# EAGLE schematic Symposion_K3_Arduino-Peripherie-IF (EAGLE 9.6.2)
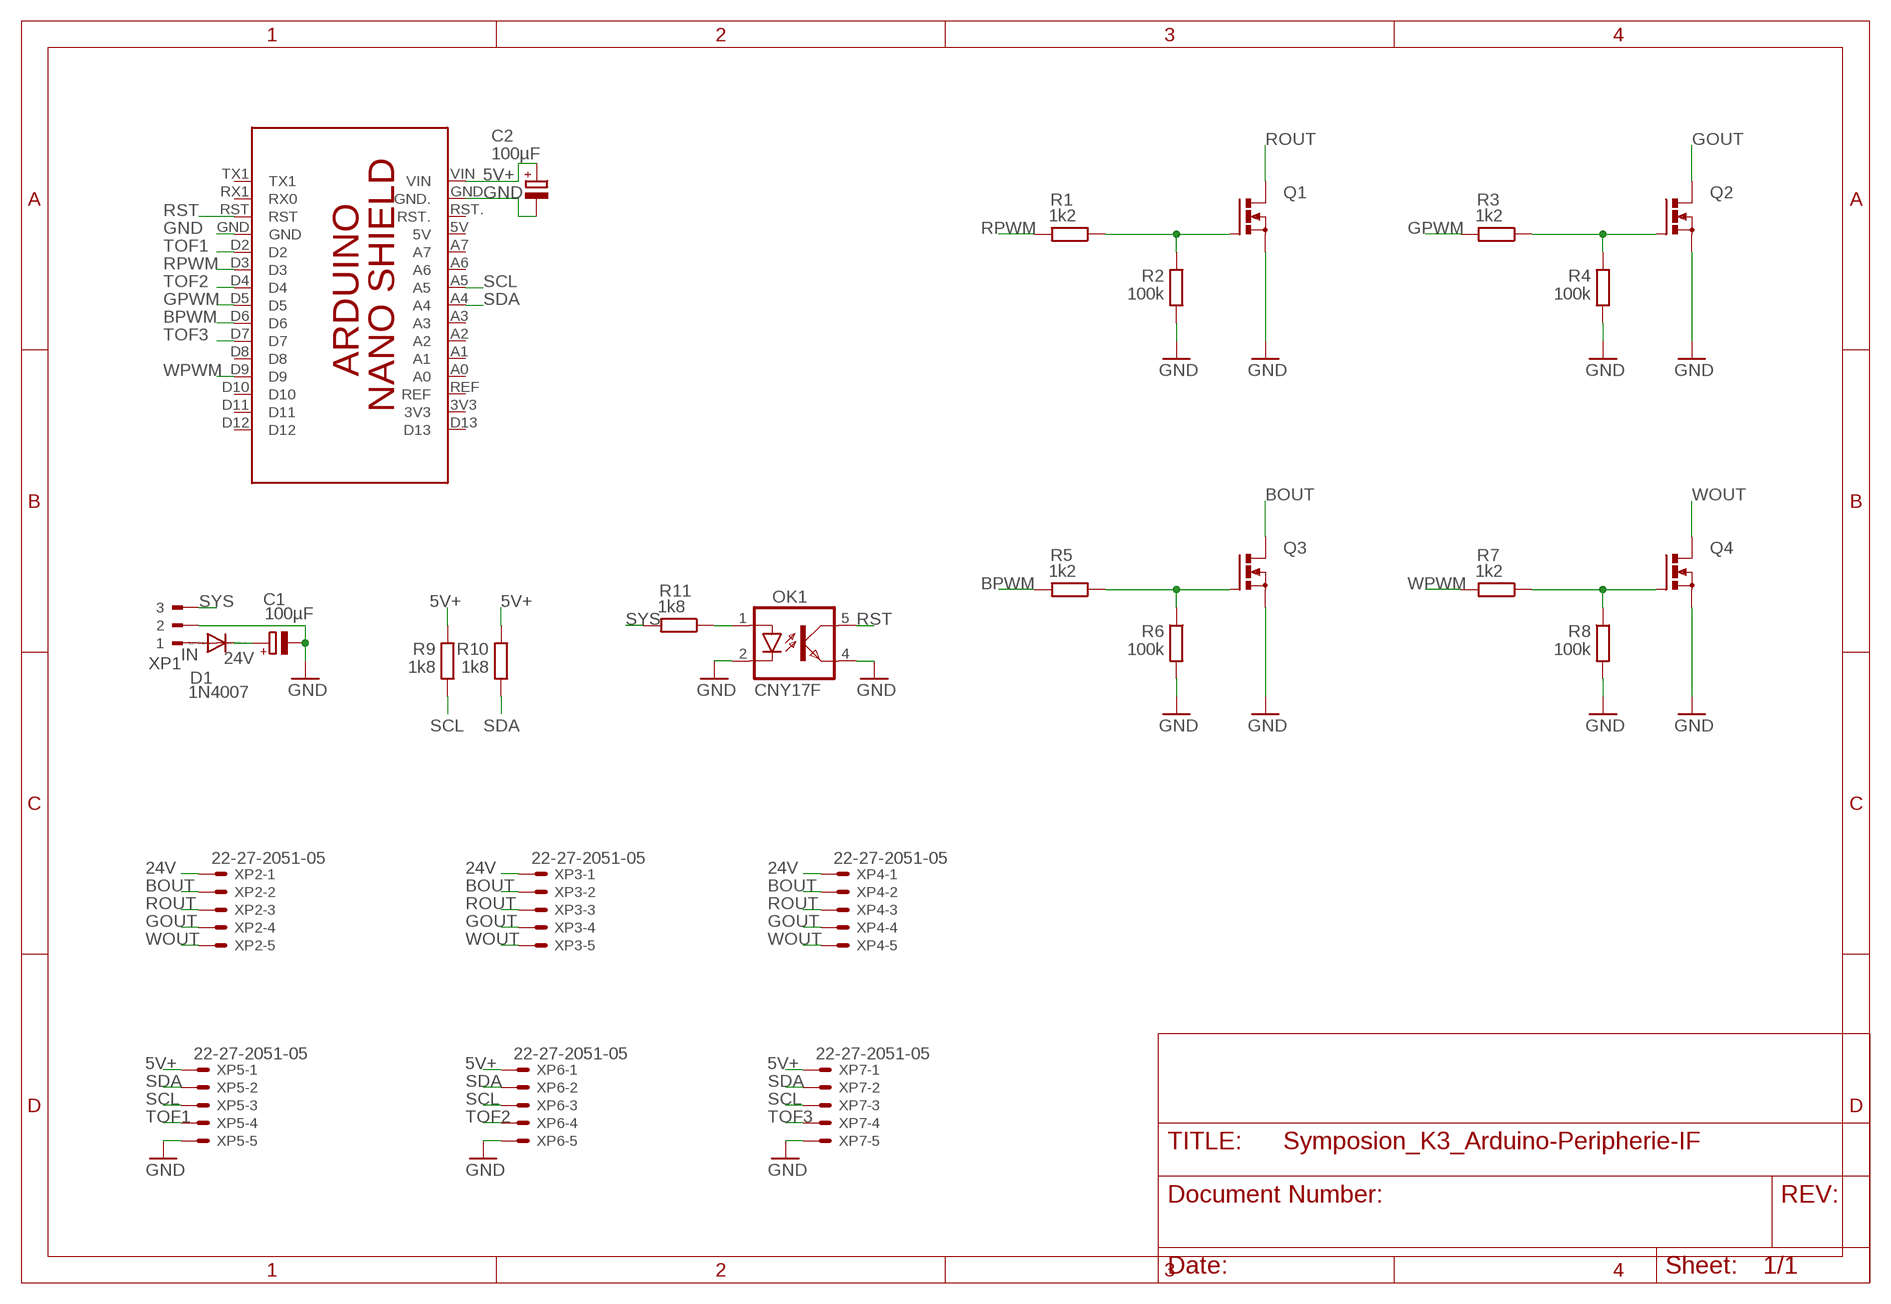
[diagram p0: schematic, sheet 1]

## Parts
C1  100µF  RCL_CPOL-EUE5-6  [RCL_E5-6]
C2  100µF  RCL_CPOL-EUE5-6  [RCL_E5-6]
D1  1N4007  DIODE_DIODE-F126-10  [DIODE_F126-10]
OK1  CNY17F  [DIL06]
PCB1  0_WSH_FAVORITES_ARDUINO_NANO  [0_WSH_FAVORITES_ARDUINO_NANO]
Q1  0_WSH_FAVORITES_BUZ11BV  [0_WSH_FAVORITES_TO220BV]
Q2  0_WSH_FAVORITES_BUZ11BV  [0_WSH_FAVORITES_TO220BV]
Q3  0_WSH_FAVORITES_BUZ11BV  [0_WSH_FAVORITES_TO220BV]
Q4  0_WSH_FAVORITES_BUZ11BV  [0_WSH_FAVORITES_TO220BV]
R1  1k2  R-EU_R1206  [R1206]
R2  100k  R-EU_R1206  [R1206]
R3  1k2  R-EU_R1206  [R1206]
R4  100k  R-EU_R1206  [R1206]
R5  1k2  R-EU_R1206  [R1206]
R6  100k  R-EU_R1206  [R1206]
R7  1k2  R-EU_R1206  [R1206]
R8  100k  R-EU_R1206  [R1206]
R9  1k8  R-EU_R1206  [R1206]
R10  1k8  R-EU_R1206  [R1206]
R11  1k8  R-EU_R1206  [R1206]
XP1  180-3  [180-3]
XP2  22-27-2051-05  [6410-05]
XP3  22-27-2051-05  [6410-05]
XP4  22-27-2051-05  [6410-05]
XP5  22-27-2051-05  [6410-05]
XP6  22-27-2051-05  [6410-05]
XP7  22-27-2051-05  [6410-05]

## Nets
5V+: C2.+ PCB1.VIN R9.1 R10.1 XP5.1 XP6.1 XP7.1
24V: C1.+ D1.C XP2.1 XP3.1 XP4.1
BOUT: Q3.D XP2.2 XP3.2 XP4.2
BPWM: PCB1.D6 R5.2
GND: C1.- C2.- OK1.2(C) OK1.4(EMIT) PCB1.GND PCB1.GND. Q1.S Q2.S Q3.S Q4.S R2.2 R4.2 R6.2 R8.2 XP1.2 XP5.5 XP6.5 XP7.5
GOUT: Q2.D XP2.4 XP3.4 XP4.4
GPWM: PCB1.D5 R3.2
IN: D1.A XP1.1
N$1: Q1.G R1.1 R2.1
N$2: OK1.1(A) R11.1
N$4: Q2.G R3.1 R4.1
N$7: Q3.G R5.1 R6.1
N$10: Q4.G R7.1 R8.1
ROUT: Q1.D XP2.3 XP3.3 XP4.3
RPWM: PCB1.D3 R1.2
RST: OK1.5(COL) PCB1.RST
SCL: PCB1.A5 R9.2 XP5.3 XP6.3 XP7.3
SDA: PCB1.A4 R10.2 XP5.2 XP6.2 XP7.2
SYS: R11.2 XP1.3
TOF1: PCB1.D2 XP5.4
TOF2: PCB1.D4 XP6.4
TOF3: PCB1.D7 XP7.4
WOUT: Q4.D XP2.5 XP3.5 XP4.5
WPWM: PCB1.D9 R7.2
Unconnected: PCB1.3V3 PCB1.5V PCB1.A0 PCB1.A1 PCB1.A2 PCB1.A3 PCB1.A6 PCB1.A7 PCB1.D8 PCB1.D10 PCB1.D11 PCB1.D12 PCB1.D13 PCB1.REF PCB1.RST. PCB1.RX1(RX0) PCB1.TX1

## Library data of the parts
C1 C2 = 20221130_WSH_Eagle_Lib:RCL_CPOL-EU: POLARIZED CAPACITOR, European symbol
D1 = 20221130_WSH_Eagle_Lib:DIODE_DIODE-: DIODE
OK1 = optocoupler:CNY17F: SIEMENS OPTO COUPLER; MF: VISHAY/TELEFUNKEN; MPN: CNY17F-3; OC_FARNELL: 1469473; OC_NEWARK: 58K0172
PCB1 = 20221130_WSH_Eagle_Lib:0_WSH_FAVORITES_ARDUINO_NANO: Device for representing an Arduino Nano shield
Q1-Q4 = 20221130_WSH_Eagle_Lib:0_WSH_FAVORITES_BUZ11: N-CHANNEL MOS FET
R1-R11 = resistor:R-EU_: RESISTOR, European symbol
XP1 = con-weidmueller-sl35:180-3: WEIDMUELLER CLAMP CONNECTOR; OC_FARNELL: unknown; OC_NEWARK: unknown
XP2-XP7 = con-molex:22-?-05: CONNECTOR wire to board 2.54 mm (.1 inch) pitch header; MF: MOLEX; OC_FARNELL: unknown; OC_NEWARK: unknown